# EAGLE design Qwiic_Spectral_Sensor-AS7265x (EAGLE 9.2.1)

## Sheet 1 of 2
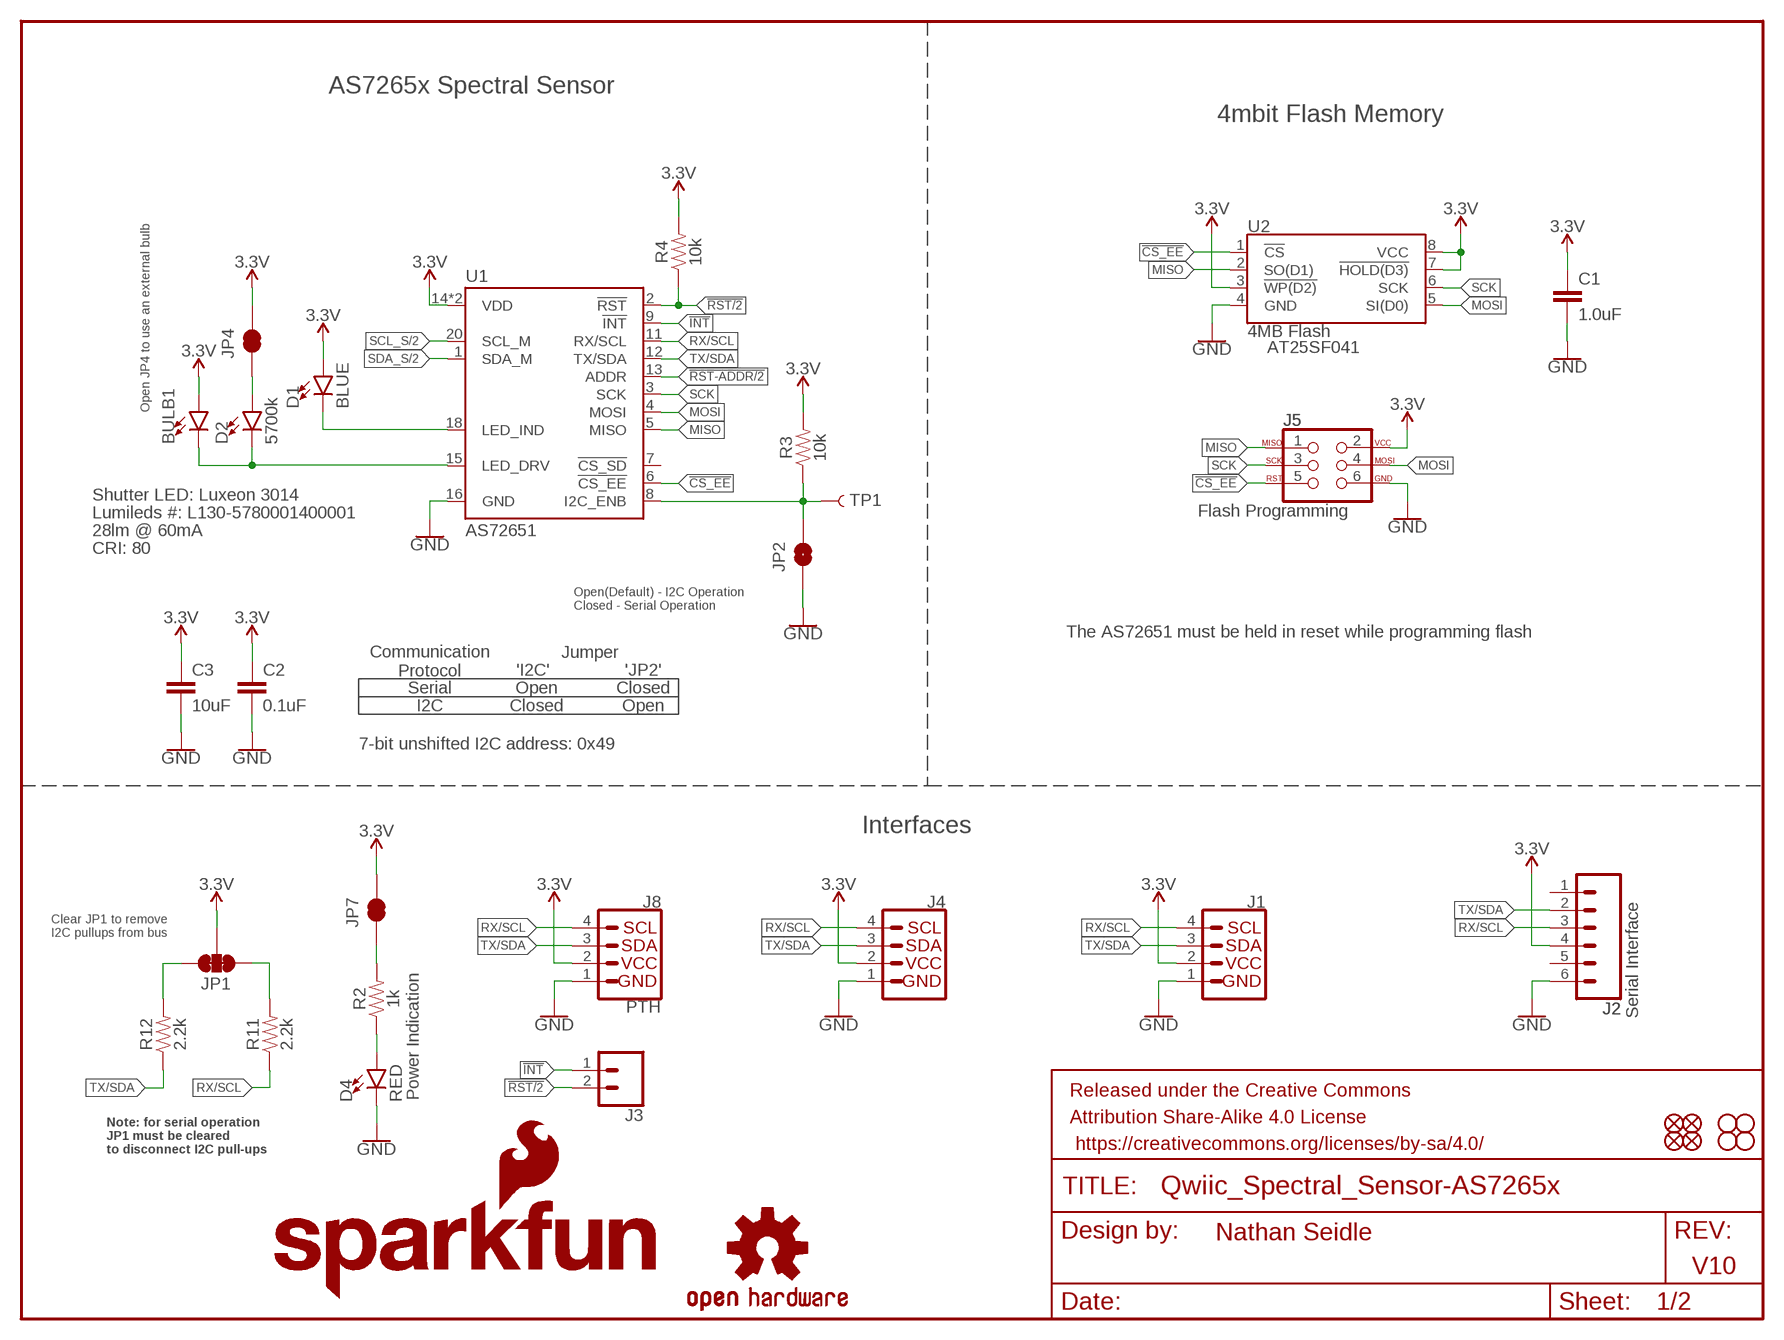
[diagram p0: schematic, sheet 1]

### Parts
BULB1  LEDNS  [LED_5MM_NOSILK]
C1  1.0uF  1.0UF-0603-16V-10%  [0603]
C2  0.1uF  0.1UF-0603-25V-(+80/-20%)  [0603]
C3  10uF  10UF-0603-6.3V-20%  [0603]
D1  BLUE  LED-BLUE0603  [LED-0603]
D2  5700k  LED-WHITE3014  [SUPER_BRIGHT_SMD_LED_3014]
D4  RED  LED-RED0603  [LED-0603]
FD1  FIDUCIAL1X2  [FIDUCIAL-1X2]
FD2  FIDUCIAL1X2  [FIDUCIAL-1X2]
FD3  FIDUCIAL1X2  [FIDUCIAL-1X2]
FD4  FIDUCIAL1X2  [FIDUCIAL-1X2]
FRAME1  FRAME-LETTER  [CREATIVE_COMMONS]
H1  STAND-OFF  [STAND-OFF]
H2  STAND-OFF  [STAND-OFF]
H3  STAND-OFF  [STAND-OFF]
H4  STAND-OFF  [STAND-OFF]
J1  QWIIC_CONNECTORJS-1MM  [1X04_1MM_RA]
J2  Serial Interface  CONN_06NO_SILK_FEMALE_PTH  [1X06_NO_SILK]
J3  CONN_021X02_NO_SILK  [1X02_NO_SILK]
J4  QWIIC_CONNECTORJS-1MM  [1X04_1MM_RA]
J5  Flash Programming  AVR_SPI_PROG_3X2TESTPOINTS  [2X3_TEST_POINTS]
J8  PTH  I2C_STANDARD_NO_SILK  [1X04_NO_SILK]
JP1  JUMPER-SMT_3_2-NC_TRACE_SILK  [SMT-JUMPER_3_2-NC_TRACE_SILK]
JP2  JUMPER-SMT_2_NO_SILK  [SMT-JUMPER_2_NO_SILK]
JP4  JUMPER-SMT_2_NC_TRACE_NO-SILK  [SMT-JUMPER_2_NC_TRACE_NO-SILK]
JP7  JUMPER-SMT_2_NC_TRACE_NO-SILK  [SMT-JUMPER_2_NC_TRACE_NO-SILK]
LOGO1  SFE_LOGO_NAME_FLAME.1_INCH  [SFE_LOGO_NAME_FLAME_.1]
LOGO4  OSHW-LOGOS  [OSHW-LOGO-S]
R2  1k  1KOHM-0603-1/10W-1%  [0603]
R3  10k  10KOHM-0603-1/10W-1%  [0603]
R4  10k  10KOHM-0603-1/10W-1%  [0603]
R11  2.2k  2.2KOHM-0603-1/10W-1%  [0603]
R12  2.2k  2.2KOHM-0603-1/10W-1%  [0603]
TP1  TEST-POINT3  [PAD.03X.03]
U1  AS72651  [LGA20]
U2  4MB Flash  AT25SF041  [SO08]

### Nets
3.3V [Power]: BULB1.A C1.1 C2.1 C3.1 D1.A J1.2 J2.4 J4.2 J5.2 J8.2 JP1.2 JP4.2 JP7.2 R3.2 R4.2 U1.14(VDD) U1.17(VDD) U2.3(!WP(D2)) U2.7(!HOLD(D3)) U2.8(VCC) ; also sheet 2
!CS_EE: J5.5 U1.6(!CS_EE) U2.1(!CS)
!INT: J3.1 U1.9(!INT)
!RST: J3.2 R4.1 U1.2(!RST) ; also sheet 2
!RST-ADDR: U1.13(ADDR) ; also sheet 2
GND: C1.2 C2.2 C3.2 D4.C J1.1 J2.6 J4.1 J5.6 J8.1 JP2.1 U1.16(GND) U2.4(GND) ; also sheet 2
I2C_ENB: JP2.2 R3.1 TP1.P$1 U1.8(I2C_ENB)
LED_DRV: BULB1.K(C) D2.C U1.15(LED_DRV)
MISO: J5.1 U1.5(MISO) U2.2(SO(D1))
MOSI: J5.4 U1.4(MOSI) U2.5(SI(D0))
N$1: JP7.1 R2.2
N$2: D1.C U1.18(LED_IND)
N$4: JP1.3 R12.2
N$5: JP1.1 R11.2
N$6: D2.A JP4.1
N$7: D4.A R2.1
RX/SCL: J1.4 J2.3 J4.4 J8.4 R11.1 U1.11(RX/SCL)
SCK: J5.3 U1.3(SCK) U2.6(SCK)
SCL_S: U1.20(SCL_M) ; also sheet 2
SDA_S: U1.1(SDA_M) ; also sheet 2
TX/SDA: J1.3 J2.2 J4.3 J8.3 R12.1 U1.12(TX/SDA)
Unconnected: J2.1 J2.5 U1.7(!CS_SD)

### Notes on the sheet
- AS7265x Spectral Sensor
- 4mbit Flash Memory
- AT25SF041
- Open JP4 to use an external bulb
- Shutter LED: Luxeon 3014
- Lumileds #: L130-5780001400001
- 28lm @ 60mA
- CRI: 80
- Open(Default) - I2C Operation
  Closed - Serial Operation
- The AS72651 must be held in reset while programming flash
- Jumper
- Communication
  Protocol
- 'I2C' | 'JP2'
- Serial | Open | Closed
- I2C | Closed | Open
- 7-bit unshifted I2C address: 0x49
- Interfaces
- Clear JP1 to remove
  I2C pullups from bus
- Power Indication
- Note: for serial operation
  JP1 must be cleared
  to disconnect I2C pull-ups
- Nathan Seidle
- V10

## Sheet 2 of 2
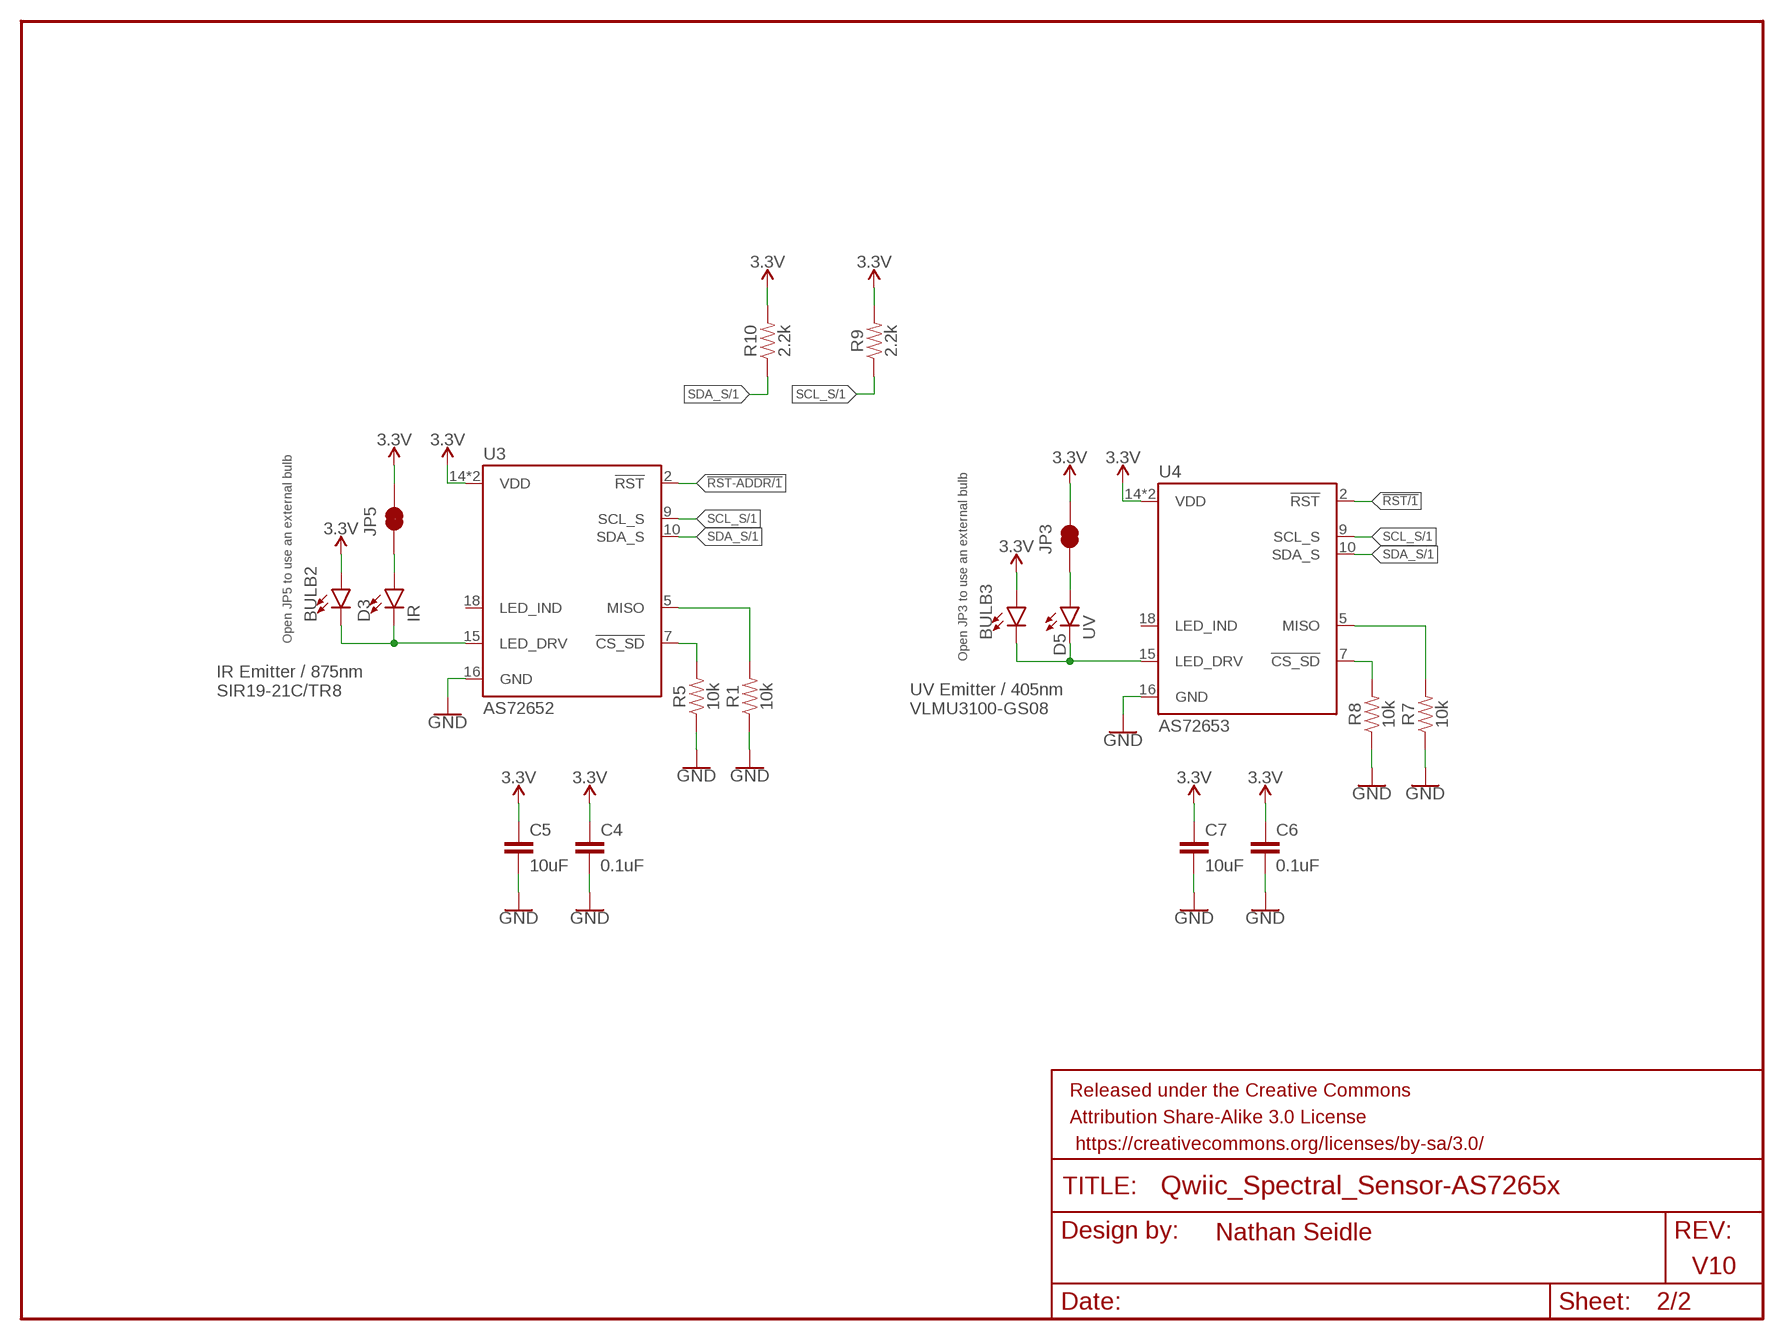
[diagram p1: schematic, sheet 2]

### Parts
BULB2  LEDNS  [LED_5MM_NOSILK]
BULB3  LEDNS  [LED_5MM_NOSILK]
C4  0.1uF  0.1UF-0603-25V-(+80/-20%)  [0603]
C5  10uF  10UF-0603-6.3V-20%  [0603]
C6  0.1uF  0.1UF-0603-25V-(+80/-20%)  [0603]
C7  10uF  10UF-0603-6.3V-20%  [0603]
D3  IR  LED-IR0603  [LED-0603]
D5  UV  LED-UVPLCC  [PLCC-2]
FRAME3  FRAME-LETTER  [CREATIVE_COMMONS]
JP3  JUMPER-SMT_2_NC_TRACE_NO-SILK  [SMT-JUMPER_2_NC_TRACE_NO-SILK]
JP5  JUMPER-SMT_2_NC_TRACE_NO-SILK  [SMT-JUMPER_2_NC_TRACE_NO-SILK]
R1  10k  10KOHM-0603-1/10W-1%  [0603]
R5  10k  10KOHM-0603-1/10W-1%  [0603]
R7  10k  10KOHM-0603-1/10W-1%  [0603]
R8  10k  10KOHM-0603-1/10W-1%  [0603]
R9  2.2k  2.2KOHM-0603-1/10W-1%  [0603]
R10  2.2k  2.2KOHM-0603-1/10W-1%  [0603]
U3  AS72652  [LGA20]
U4  AS72653  [LGA20]

### Nets
3.3V [Power]: BULB2.A BULB3.A C4.1 C5.1 C6.1 C7.1 JP3.2 JP5.2 R9.2 R10.2 U3.14(VDD) U3.17(VDD) U4.14(VDD) U4.17(VDD) ; also sheet 1
!RST: U4.2(!RST) ; also sheet 1
!RST-ADDR: U3.2(!RST) ; also sheet 1
GND: C4.2 C5.2 C6.2 C7.2 R1.1 R5.1 R7.1 R8.1 U3.16(GND) U4.16(GND) ; also sheet 1
LED_DRV1: BULB2.K(C) D3.C U3.15(LED_DRV)
LED_DRV2: BULB3.K(C) D5.C U4.15(LED_DRV)
N$3: R5.2 U3.7(!CS_SD)
N$8: D3.A JP5.1
N$9: R1.2 U3.5(MISO)
N$11: D5.A JP3.1
N$12: R8.2 U4.7(!CS_SD)
N$13: R7.2 U4.5(MISO)
SCL_S: R9.1 U3.9(SCL_S) U4.9(SCL_S) ; also sheet 1
SDA_S: R10.1 U3.10(SDA_S) U4.10(SDA_S) ; also sheet 1
Unconnected: U3.18(LED_IND) U4.18(LED_IND)

### Notes on the sheet
- Open JP5 to use an external bulb
- Open JP3 to use an external bulb
- IR Emitter / 875nm
  SIR19-21C/TR8
- UV Emitter / 405nm
  VLMU3100-GS08
- Nathan Seidle
- V10

## Library data of the parts
BULB1-BULB3 = SparkX:LED
C1 = SparkFun-Capacitors:1.0UF: 1µF ceramic capacitors A capacitor is a passive two-terminal electrical component used to store electrical energy temporarily in an electric field.; PROD_ID: CAP-00868
C2 C4 C6 = SparkFun-Capacitors:0.1UF: 0.1µF ceramic capacitors A capacitor is a passive two-terminal electrical component used to store electrical energy temporarily in an electric field.; PROD_ID: CAP-00810
C3 C5 C7 = SparkFun-Capacitors:10UF: 10.0µF ceramic capacitors A capacitor is a passive two-terminal electrical component used to store electrical energy temporarily in an electric field.; PROD_ID: CAP-11015
D1 = SparkFun-LED:LED-BLUE: Blue SMD LED Used in manufacturing of various products at SparkFun Packages: 0603 - SMD 0603 package [Product Link] <http://www.digikey.com/product-detail/en/SMLE12BC7TT86/511-1589-2-ND/1641808> 1206 - SMD1206 package [Product Link] <http://www.digikey.com/product-detail/en/lite-on-inc/LTST-C150TBKT/160-1643-1-ND/573584> SparkFun Products: ESP8266 Thing-Dev Board <https://www.sparkfun.com/products/13711> RedBoard <https://www.sparkfun.com/products/12757>; PROD_ID: DIO-08575
D2 = SparkFun-LED:LED-WHITE: White SMD LED Used in manufacturing several products at SparkFun. Packages: 0603 - Bright White SMD 0603 package[Product Link] <http://www.kingbrightusa.com/product.asp?catalog_name=LED&product_id=APT1608QWF/D> 1206 - Bright White SMD1206 package [Product Link] <http://www.kingbrightusa.com/product.asp?catalog_name=LED&product_id=APT3216QWF/D> 3014 - Super Bright SMD 3014 package [Datasheet] <http://www.lumileds.com/uploads/459/DS208-pdf> SparkFun Products: Blackberry Trackballer Breakout <https://www.sparkfun.com/products/13169> Digital SandBox <https://www.sparkfun.com/products/12651>; PROD_ID: DIO-13728; VALUE: White, 60mA
D3 = SparkFun-LED:LED-IR: Infrared LED (IR) Wavelength: 940nm Packages: TSAL6100 LTE302 - Side firing. Check SparkFun-Sensors.lbr for the receiver SparkFun Products: ZX Distance and Gesture Sensor <[https://www.sparkfun.com/products/12780]> Infrared Emitters and Detectors <https://www.sparkfun.com/products/241>; PROD_ID: DIO-14125
D4 = SparkFun-LED:LED-RED: Red SMD LED Used in manufacturing of most products at SparkFun Packages: 0603 - SMD 0603 package [Product Link] <http://docs.avagotech.com/docs/AV02-0551EN> 0603 SMART - SMD 0603 SMART package ( more efficient and expensive)[Product Link] <http://www.osram-os.com/Graphics/XPic2/00077099_0.pdf> 1206 - SMD1206 package [Product Link] <https://www.sparkfun.com/datasheets/DevTools/LilyPad/Q150OVS4.pdff> SparkFun Products: Pro Mini 328 -5V <https://www.sparkfun.com/products/821> RedBoard <https://www.sparkfun.com/products/12757> IOIO-OTG <https://www.sparkfun.com/products/13613>; PROD_ID: DIO-00819
D5 = SparkFun-LED:LED-UV; PROD_ID: DIO-14126
FD1-FD4 = SparkFun-Aesthetics:FIDUCIAL: Fiducial Alignment Points Point-of-reference for pick-and-place machines and other optical instruments.
FRAME1 = SparkFun-Aesthetics:FRAME-LETTER: Schematic Frame - Letter Standard 8.5x11 US Letter frame
FRAME3 = SparkFun-Retired:FRAME-LETTER: Schematic Frame Standard 8.5x11 US Letter frame
H1-H4 = SparkFun-Hardware:STAND-OFF: Stand Off Drill holes for mechanically mounting via screws, standoffs, etc. Note: Use the keepout ring to avoid running the screw head into surrounding components. Variant Overviews STAND-OFF - Mechanical footprint for a #4 phillips button head screw. STAND-OFF-TIGHT - Mechanical footprint for a #4 phillips button head screw, Example SparkFun Products Screw - Phillips Head (1/4", 4-40, 10 pack) <https://www.sparkfun.com/products/10453> (PRT-10453) Screw - Phillips Head (1/2", 4-40, 10 pack) <https://www.sparkfun.com/products/10452> (PRT-10452) Screw - Phillips Head (3/4", 4-40, 10 pack) <https://www.sparkfun.com/products/10451> (PRT-10451) Screw - Phillips Head (1", 4-40, 10 pack) <https://www.sparkfun.com/products/10450> (PRT-10450)
J1 J4 = SparkFun-Connectors:QWIIC_CONNECTOR: SparkFun I2C Standard Qwiic Connector An SMD 1mm pitch JST connector makes it easy and quick (get it? Qwiic?) to connect I2C devices to each other. The Qwiic system <http://www.sparkfun.com/qwiic> enables fast and solderless connection between popular platforms and various sensors and actuators. We carry 200mm <https://www.sparkfun.com/products/14204>, 100mm <https://www.sparkfun.com/products/14205>, 50mm <https://www.sparkfun.com/products/14206>, and breadboard friendly <https://www.sparkfun.com/products/14207> Qwiic cables. We also offer 10 pcs strips <https://www.sparkfun.com/products/14323> the SMD connectors.; PROD_ID: CONN-13694
J2 = SparkFun-Connectors:CONN_06: Multi connection point. Often used as Generic Header-pin footprint for 0.1 inch spaced/style header connections On any of the 0.1 inch spaced packages, you can populate with these: Break Away Headers - Straight <https://www.sparkfun.com/products/116> (PRT-00116) Break Away Male Headers - Right Angle <https://www.sparkfun.com/products/553> (PRT-00553) Female Headers <https://www.sparkfun.com/products/115> (PRT-00115) Break Away Headers - Machine Pin <https://www.sparkfun.com/products/117> (PRT-00117) Break Away Female Headers - Swiss Machine Pin <https://www.sparkfun.com/products/743> (PRT-00743) Arduino Stackable Header - 6 Pin <https://www.sparkfun.com/products/9280> (PRT-09280) For SCREWTERMINALS and SPRING TERMINALS visit here: Screw Terimnals on SparkFun.com <https://www.sparkfun.com/search/results?term=Screw+Terminals> (5mm/3.5mm/2.54mm spacing) This device is also useful as a general connection point to wire up your design to another part of your project. Our various solder wires solder well into these plated through hole pads. Hook-Up Wire - Assortment (Stranded, 22 AWG) <https://www.sparkfun.com/products/11375> (PRT-11375) Hook-Up Wire - Assortment (Solid Core, 22 AWG) <https://www.sparkfun.com/products/11367> (PRT-11367) View the entire wire category on our website here <https://www.sparkfun.com/categories/141>; PROD_ID: CONN-08437
J3 = SparkFun-Connectors:CONN_02: Multi connection point. Often used as Generic Header-pin footprint for 0.1 inch spaced/style header connections On any of the 0.1 inch spaced packages, you can populate with these: Break Away Headers - Straight <https://www.sparkfun.com/products/116> (PRT-00116) Break Away Male Headers - Right Angle <https://www.sparkfun.com/products/553> (PRT-00553) Female Headers <https://www.sparkfun.com/products/115> (PRT-00115) Break Away Headers - Machine Pin <https://www.sparkfun.com/products/117> (PRT-00117) Break Away Female Headers - Swiss Machine Pin <https://www.sparkfun.com/products/743> (PRT-00743) For SCREWTERMINALS and SPRING TERMINALS visit here: Screw Terimnals on SparkFun.com <https://www.sparkfun.com/search/results?term=Screw+Terminals> (5mm/3.5mm/2.54mm spacing) This device is also useful as a general connection point to wire up your design to another part of your project. Our various solder wires solder well into these plated through hole pads. Hook-Up Wire - Assortment (Stranded, 22 AWG) <https://www.sparkfun.com/products/11375> (PRT-11375) Hook-Up Wire - Assortment (Solid Core, 22 AWG) <https://www.sparkfun.com/products/11367> (PRT-11367) View the entire wire category on our website here <https://www.sparkfun.com/categories/141> Special notes: Molex polarized connector foot print use with: PRT-08233 with associated crimp pins and housings. 2.54_SCREWTERM for use with PRT-10571. 3.5mm Screw Terminal footprints for PRT-08084 5mm Screw Terminal footprints for use with PRT-08432
J5 = SparkFun-Connectors:AVR_SPI_PROG_3X2: AVR ISP 6 Pin This is the reduced ISP connector for AVR programming. Common on Arduino. This footprint will take up less PCB space and can be used with a 10-pin to 6-pin adapter such as SKU: BOB-08508 **Special note about "TEST_POINT" package. The stop mask is on the top side, so if you want your programming test points to be on the bottom of your board, make sure to place this package on the bottom side of the board. This also ensure that the orientation to program from the bottom side will be correct. SparkFun Products: SparkFun ISP Pogo Adapter <https://www.sparkfun.com/products/11591> - NS Tiny AVR Programmer <https://www.sparkfun.com/products/11801> -PTH
J8 = SparkFun-Connectors:I2C_STANDARD: SparkFun I2C Standard Pinout Header SparkFun has standardized on a pinout for all I2C based sensor breakouts. This pinout allows I2C boards to be plugged directly into the headers on Arduino Uno compatible boards, and to be daisy chained easily. Example SparkFun Products: SparkFun Atmospheric Sensor Breakout - BME280 <https://www.sparkfun.com/products/13676> SparkFun Altitude/Pressure Sensor Breakout - MPL3115A2 <https://www.sparkfun.com/products/11084> SparkFun TOF Range Finder Sensor - VL6180 <https://www.sparkfun.com/products/12785>
JP1 = SparkFun-Jumpers:JUMPER-SMT_3_2-NC_TRACE: Normally closed trace jumper (2 of 2 connections) This jumper has a trace between all three pads so they are normally closed (NC). Use a razor knife to open the connection(s). For best results follow the IPC guidelines for cutting traces: Cutout at least 0.063 mm (0.005 in). Remove all loose material to clean up the cut area. Seal the cut with an approved epoxy. Reapply solder to reclose the connection(s).
JP2 = SparkFun-Jumpers:JUMPER-SMT_2_NO: Normally open jumper This jumper has two pads in close proximity to each other. Apply solder to close the connection. Round pads are easier to solder for beginners, but are a lot larger. SparkFun Product that uses the round pads: SparkFun EL Sequencer <https://www.sparkfun.com/products/12781>
JP3-JP5 JP7 = SparkFun-Jumpers:JUMPER-SMT_2_NC_TRACE: Normally closed trace jumper This jumper has a trace between two pads so it's normally closed (NC). Use a razor knife to open the connection. For best results follow the IPC guidelines for cutting traces: Cutout at least 0.063 mm (0.005 in). Remove all loose material to clean up the cut area. Seal the cut with an approved epoxy. Reapply solder to reclose the connection.
LOGO1 = SparkFun-Aesthetics:SFE_LOGO_NAME_FLAME: SparkFun Font Logo w/ Flame This is the SparkFun full logo. The logo on the schematic will always be the same size; the package variant is the height of the flame part of the logo. Default layer for the logo on the board is tSilk.
LOGO4 = SparkFun-Aesthetics:OSHW-LOGO: Open-Source Hardware (OSHW) Logo This logo indicates the piece of hardware it is found on incorporates a OSHW license and/or adheres to the definition of open source hardware found here: http://freedomdefined.org/OSHW
R1 R3-R5 R7 R8 = SparkFun-Resistors:10KOHM: 10kΩ resistor A resistor is a passive two-terminal electrical component that implements electrical resistance as a circuit element. Resistors act to reduce current flow, and, at the same time, act to lower voltage levels within circuits. - Wikipedia; PROD_ID: RES-00824
R2 = SparkFun-Resistors:1KOHM: 1kΩ resistor A resistor is a passive two-terminal electrical component that implements electrical resistance as a circuit element. Resistors act to reduce current flow, and, at the same time, act to lower voltage levels within circuits. - Wikipedia; PROD_ID: RES-07856
R9-R12 = SparkFun-Resistors:2.2KOHM: 2.2kΩ resistor A resistor is a passive two-terminal electrical component that implements electrical resistance as a circuit element. Resistors act to reduce current flow, and, at the same time, act to lower voltage levels within circuits. - Wikipedia; PROD_ID: RES-08272
TP1 = SparkFun-Connectors:TEST-POINT: SparkFun Test Points Bare copper test points for troubleshooting or In-Circuit-Testing. These are used by our Production team for verifying production board runs using pogo-pins on test beds. SparkFun Products: SparkFun LSM9DS1 Breakout <https://www.sparkfun.com/products/13284> SparkFun PSOC <https://www.sparkfun.com/products/13714> SparkFun Load Cell Amplifier <https://www.sparkfun.com/products/13879>
U1 = Qwiic_Spectral_Sensor-AS7265x:AS72651; PROD_ID: IC-14127
U2 = SparkFun-IC-Memory:AT25SF041: AT25SF041 4Mb Serial Flash Memory 104MHz, SPI, 8-SOIC Datasheet <http://www.adestotech.com/wp-content/uploads/DS-AT25SF041_044.pdf> SparkFun Products: SparkFun ESP8266 Thing <https://www.sparkfun.com/products/13231> SparkFun ESP8266 Thing - Dev Board <https://www.sparkfun.com/products/13711>; PROD_ID: IC-12455
U3 = Qwiic_Spectral_Sensor-AS7265x:AS72652; PROD_ID: IC-14128
U4 = Qwiic_Spectral_Sensor-AS7265x:AS72653; PROD_ID: IC-14129

## Net classes
1 Power: width 0.305 mm

## Board
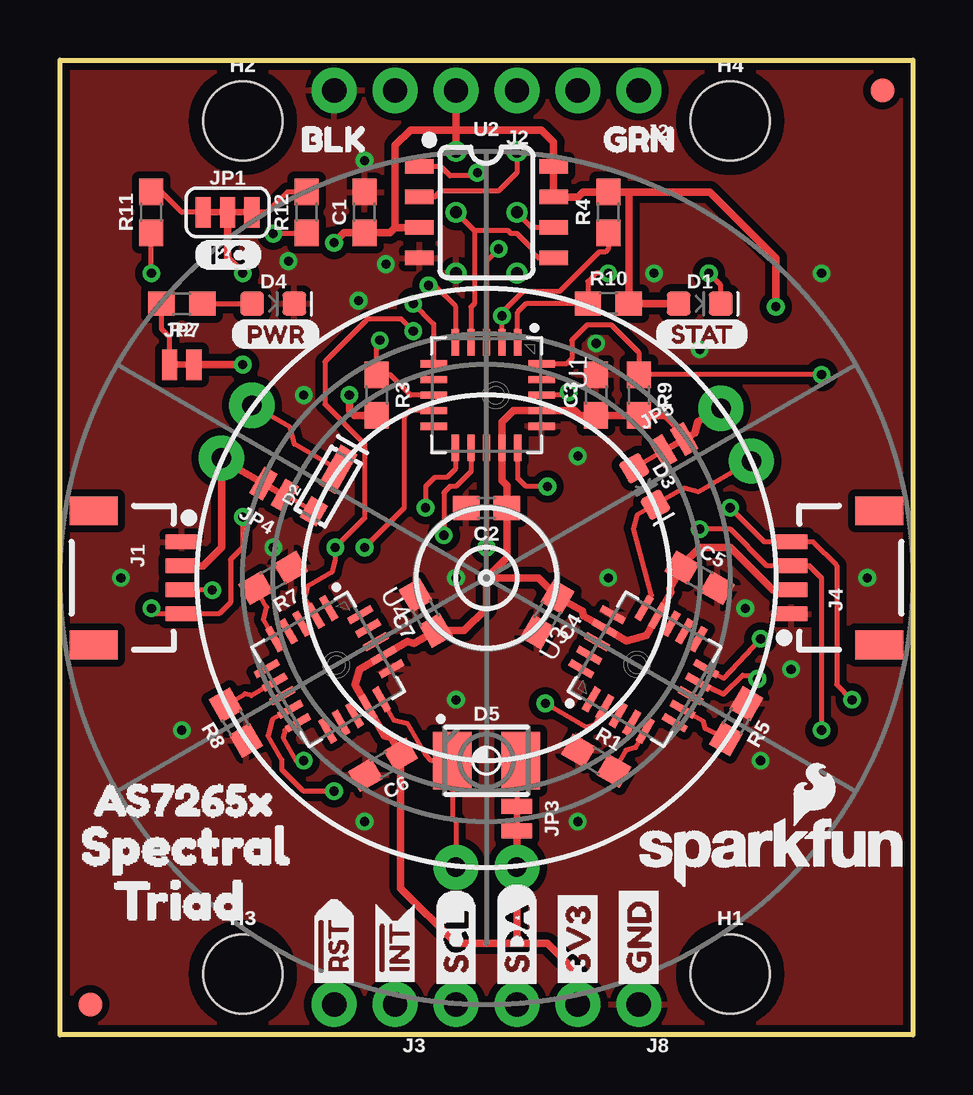
[diagram p2: board, top side]
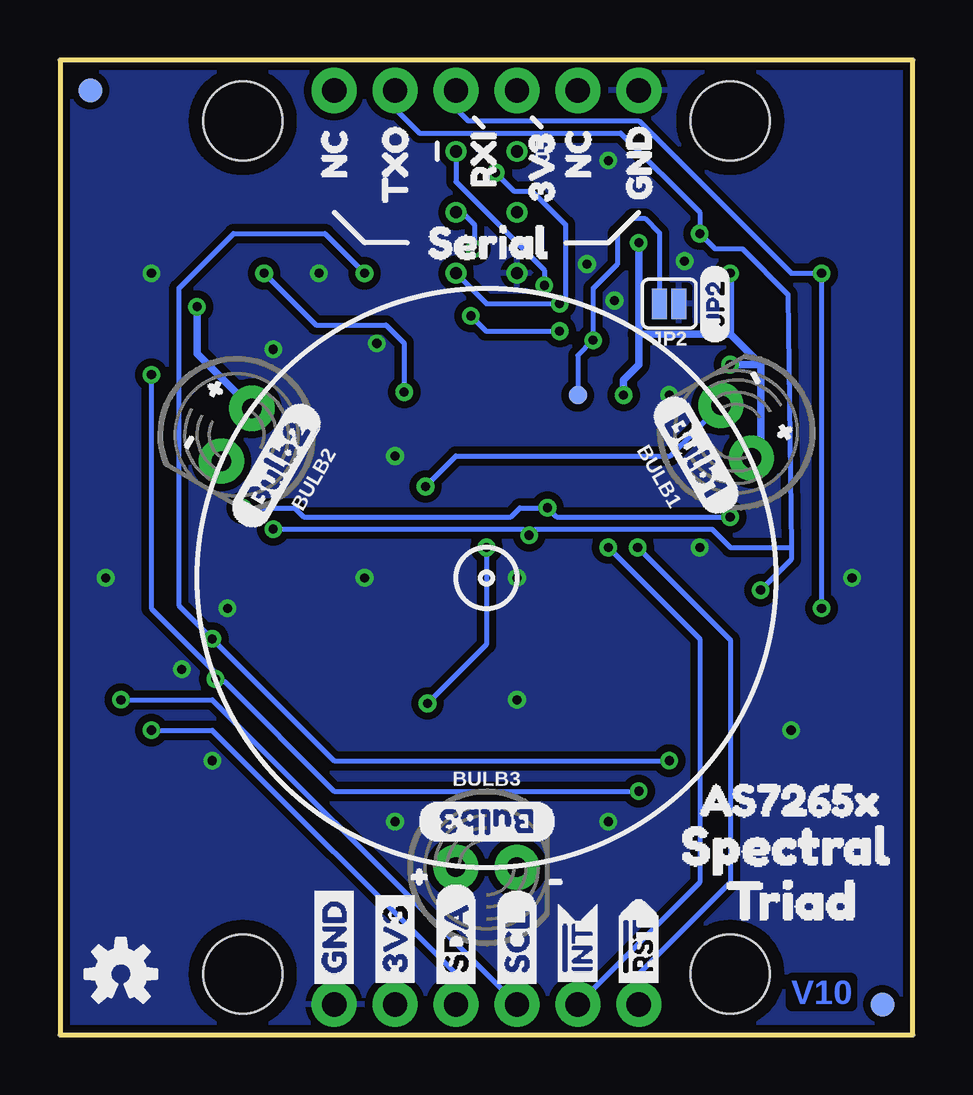
[diagram p3: board, bottom side, seen from below]

Size 35.56 x 40.64 mm. Coordinates in mm from the lower left corner, seen from the top.
Outline: 0,0 0,40.64 35.56,40.64 35.56,0 0,0
Copper layers (1*16): Top 0.035mm / dielectric 1.5mm / Bottom 0.035mm
Design rules "SparkFun-2-layer-TIGHT *": minimum track width 7mil, minimum drill 15mil, track to track 7mil, track to pad 7mil, pad to pad 7mil, via to via 7mil, smd to smd 7mil, copper to edge 7mil, drill to drill 7mil, minimum pad ring 7mil, minimum via ring 7mil, stop-mask expansion 4mil, vias tented up to drill 25mil, thermal gap 10mil

### Footprints (pad centres in the part's own frame; a part is rotated, then mirrored left to right if it is on the bottom)
LED_5MM_NOSILK = drill 0.813 pad 1.88: A -1.27,0; K 1.27,0
0603 = smd 1.1 x 1: 1 -0.85,0; 2 0.85,0
LED-0603 = smd 1 x 1: A -0.877,0; C 0.877,0
SUPER_BRIGHT_SMD_LED_3014 = smd 1 x 0.8: A -1.2,0 | smd 1.9 x 0.8: C 0.827,0
PLCC-2 = smd 1.6 x 2.4: A 1.425,0; C -1.425,0
FIDUCIAL-1X2 = smd 1 x 1: 1 0,0
STAND-OFF = hole 3.302: 0,0
1X04_1MM_RA = smd 0.6 x 1.35: 1 -1.5,0; 2 -0.5,0; 3 0.5,0; 4 1.5,0 | smd 1.2 x 2: NC1 2.8,-3.675; NC2 -2.8,-3.675
1X06_NO_SILK = drill 1.016 pad 1.88: 1 0,0; 2 2.54,0; 3 5.08,0; 4 7.62,0; 5 10.16,0; 6 12.7,0
1X02_NO_SILK = drill 1.016 pad 1.88: 1 0,0; 2 2.54,0
2X3_TEST_POINTS = drill 0.508: 1 -2.54,-1.27; 2 -2.54,1.27; 3 0,-1.27; 4 0,1.27; 5 2.54,-1.27; 6 2.54,1.27
1X04_NO_SILK = drill 1.016 pad 1.88: 1 0,0; 2 2.54,0; 3 5.08,0; 4 7.62,0
SMT-JUMPER_3_2-NC_TRACE_SILK = smd 0.635 x 1.27: 1 -1.016,0; 2 0,0; 3 1.016,0
SMT-JUMPER_2_NO_SILK = smd 0.635 x 1.27: 1 -0.406,0; 2 0.406,0
SMT-JUMPER_2_NC_TRACE_NO-SILK = smd 0.635 x 1.27: 1 -0.508,0; 2 0.508,0
PAD.03X.03 = smd 0.762 x 0.762: P$1 0,0
LGA20 = smd 1.1 x 0.3: 1 -2.2,1.3; 2 -2.2,0.65; 3 -2.2,0; 4 -2.2,-0.65; 5 -2.2,-1.3; 11 2.2,-1.3; 12 2.2,-0.65; 13 2.2,0; 14 2.2,0.65; 15 2.2,1.3 | smd 0.3 x 1.1: 6 -1.3,-2.2; 7 -0.65,-2.2; 8 0,-2.2; 9 0.65,-2.2; 10 1.3,-2.2; 16 1.3,2.3; 17 0.65,2.3; 18 0,2.3; 19 -0.65,2.3; 20 -1.3,2.3
SO08 = smd 0.6 x 1.2: 1 -1.905,-2.8; 2 -0.635,-2.8; 3 0.635,-2.8; 4 1.905,-2.8; 5 1.905,2.8; 6 0.635,2.8; 7 -0.635,2.8; 8 -1.905,2.8

### Placement (x,y rotation side)
BULB1  7.37,25.15 120 bottom
BULB2  28.19,25.02 240 bottom
BULB3  17.78,6.99 0 bottom
C1  12.7,34.29 90 top
C2  17.78,21.97 180 top
C3  22.35,26.67 90 top
C4  20.32,17.53 240 top
C5  26.67,19.05 330 top
C6  13.47,11.26 210 top
C7  15.25,17.59 120 top
D1  26.67,30.48 0 top
D2  11.18,22.86 60 top
D3  24.38,22.86 300 top
D4  8.89,30.48 0 top
D5  17.78,11.43 0 top
FD1  1.27,1.27 0 top
FD2  34.29,39.37 0 top
FD3  34.29,39.37 0 bottom
FD4  1.27,1.27 0 bottom
FRAME1  -11.43,-30.48 0 top  (outside the outline)
FRAME3  -11.43,-40.64 0 top  (outside the outline)
H1  27.94,2.54 0 top
H2  7.62,38.1 0 top
H3  7.62,2.54 0 top
H4  27.94,38.1 0 top
J1  5.08,19.05 270 top
J2  24.13,39.37 180 top
J3  13.97,1.27 180 top
J4  30.48,19.05 90 top
J5  17.78,34.29 270 bottom
J8  24.13,1.27 180 top
JP1  6.98,34.29 0 top
JP2  10.16,30.48 180 bottom
JP3  19.05,9.02 270 top
JP4  8.93,22.73 150 top
JP5  25.58,24.58 30 top
JP7  5.08,27.94 0 top
LOGO1  29.72,7.62 0 top
LOGO4  33.02,2.54 0 bottom
R1  22.35,11.43 330 top
R2  5.08,30.48 180 top
R3  13.21,26.67 270 top
R4  22.86,34.29 90 top
R5  28.19,13.08 240 top
R7  8.89,19.05 210 top
R8  7.33,13.02 120 top
R9  24.13,26.67 270 top
R10  22.86,30.48 0 top
R11  3.81,34.29 90 top
R12  10.29,34.29 90 top
TP1  13.97,26.67 0 bottom
U1  17.78,26.67 270 top
U2  17.78,34.29 270 top
U3  24.38,15.24 60 top
U4  11.18,15.24 300 top
U$1  [#0]  29.84,25.91 60 bottom
U$2  [I_SUPER2_C-()-03]  5.59,32.51 0 top
U$3  [PWR-()-03]  7.11,29.21 0 top
U$4  [AS7265X0]  0.25,9.78 0 top
U$5  [BULB15]  10.41,26.54 300 bottom
U$6  [BULB26]  28.07,21.08 60 bottom
U$7  [BULB37]  14.86,8.89 180 bottom
U$8  [JP20]  8.25,28.83 90 bottom
U$9  [SPECTRAL1]  -0.51,7.87 0 top
U$10  [STAT4]  24.76,29.21 0 top
U$11  [TRIAD2]  0.89,5.59 0 top
U$12  [TRIAD2]  9.14,5.59 0 bottom
U$13  [SPECTRAL1]  11.05,7.87 0 bottom
U$14  [AS7265X0]  10.03,9.78 0 bottom
U$15  [3V33]  15.49,33.65 90 bottom
U$16  [BLK7]  9.14,37.34 0 top
U$17  [GND5]  11.43,33.91 90 bottom
U$18  [GRN6]  21.59,37.34 0 top
U$19  [NC4]  24.13,34.8 90 bottom
U$20  [NC4]  13.97,34.8 90 bottom
U$21  [RXI2]  17.91,34.42 90 bottom
U$22  [SERIAL0]  21.34,33.02 0 bottom
U$23  [TXO1]  21.59,33.78 90 bottom
U$24  [3V3-04]  21.59,1.65 90 bottom
U$25  [GND-04]  24.13,1.65 90 bottom
U$26  [SDA-[)]  19.05,1.65 90 bottom
U$27  [SCL-[)]  16.51,1.65 90 bottom
U$28  [INT#-[<-04]  13.97,1.52 90 bottom
U$29  [RST#-[>-04]  11.43,1.52 90 bottom
U$30  [GND-04]  24.13,1.65 90 top
U$31  [3V3-04]  21.59,1.65 90 top
U$32  [SDA-[)]  19.05,1.65 90 top
U$33  [SCL-[)]  16.51,1.65 90 top
U$34  [INT#-[<-04]  13.97,1.52 90 top
U$35  [RST#-[>-04]  11.43,1.52 90 top
U$36  [#0]  5.84,26.29 300 bottom
U$37  [#0]  21.84,6.73 0 bottom
U$38  [#1]  16.13,6.6 0 bottom
U$39  [#1]  6.98,28.57 300 bottom
U$40  [#1]  30.99,23.75 60 bottom

### Tracks (layer width: path | path; a pad name or v marks a point on that pad's centre or on a via)
3.3V  (via drill 0.38)
  Top 0.203: 25.78,30.49 D1.A
  Top 0.305: U2.3 13.97,33.65 | 20.32,37.46 20.58,37.2 U2.8 U2.7 21.59,34.92 21.8,35.14 R4.2 23.75,35.14 | BULB2.A 26.59,25.56 26.46,25.09 JP5.2 26.02,25.03 25.23,25.82 R9.2 C3.1 21.68,25.82 21.48,26.02 U1.17 18.91,26.02 18.43,25.54 U1.14 18.43,23.1 18.63,22.9 C2.1 18.63,19.9 17.78,19.05 | JP3.2 BULB3.A 19.05,3.81 | JP4.2 6.75,23.99 6.73,24 BULB1.A 6.73,20.32 5.96,19.55 J1.2 | J4.2 29.71,18.55 27.94,20.32 26.67,20.32 25.93,19.58 C5.1 25.43,18.6 25.47,18.44 U3.14 24.44,16.65 23.62,16.43 U3.17 21.83,17.46 21.78,17.67 C4.1 19.96,19.05 17.78,19.05 | 25.78,35.14 23.75,35.14 | 25.78,35.14 27.09,35.14 29.84,32.38 v29.84,30.35 | v11.43,33.02 11.85,33.44 C1.1 13.75,33.44 13.97,33.65 | R3.2 12.28,25.82 12.06,26.03 v12.06,26.67 | 17.78,19.05 17.78,17.78 16.85,16.85 C7.1 14.76,16.33 14.49,16.4 U4.17 12.48,15.24 12.31,14.59 U4.14 13.53,12.47 13.79,12.4 C6.1 14.21,6.11 16.51,3.81 19.05,3.81 | 20.32,37.46 20.07,37.72 | 16,37.72 14.6,37.72 13.97,37.08 13.97,33.65 | 19.05,3.81 20.32,3.81 21.59,2.54 J8.2 | v7.62,31.75 6.98,32.38 JP1.2 | 25.79,35.13 25.78,35.14 | 20.32,37.46 | 16,37.72 | 16.51,37.72 16,37.72 | 20.07,37.72 16.51,37.72 | 20.07,37.72 | J2.4 16.51,37.72 | 16.51,37.72 | 16.51,37.72 J5.2 | J8.2 | JP7.2 v7.62,27.94 | R10.2 23.71,35.1 23.75,35.14 | D1.A R10.2 | R10.2
  Bottom 0.305: v29.84,30.35 29.84,28.4 BULB2.A | 11.43,29.21 7.62,29.21 | 7.62,29.21 6.35,27.94 | 6.35,27.94 6.35,24.43 BULB1.A | v11.43,33.02 11.43,29.21 | 11.43,29.21 11.43,27.94 12.06,27.3 v12.06,26.67 | v7.62,31.75 7.62,29.21 | v7.62,27.94 6.35,27.94
!CS_EE  (via drill 0.38)
  Top 0.203: U1.6 15.58,29.63 v14.73,30.48 | U2.1 15.87,36.19 16.26,35.81 17.27,35.81 v17.4,35.94
  Bottom 0.203: J5.5 17.78,30.48 v14.73,30.48 14.48,30.73 14.48,33.78 15.87,35.18 16.64,35.18 v17.4,35.94
!INT  (via drill 0.38)
  Top 0.203: U1.9 14.59,26.02 14.35,25.78 14.35,21.97 v12.7,20.32
  Bottom 0.203: J3.1 | J3.1 8.89,6.35 8.89,16.51 v12.7,20.32
!RST  (via drill 0.38)
  Top 0.203: U1.2 v18.43,29.97 18.43,30.11 19.3,30.99 20.83,30.99 22.48,32.64 22.73,32.64 22.86,32.77 R4.1 | v14.73,29.34 14.22,29.84 12.83,29.84 11.05,28.07 11.05,26.29 12.7,24.64 12.7,21.54 v11.48,20.32 11.48,19.81 11.34,19.29 10.35,18.72 10.21,18.22 U4.2
  Bottom 0.203: v18.43,29.97 17.79,29.34 v14.73,29.34 | v11.48,20.32 7.62,16.46 7.62,6.35 11.43,2.54 J3.2
!RST-ADDR  (via drill 0.38)
  Top 0.203: v20.23,13.82 21.96,12.82 22.28,12.91 U3.2 | U1.13 v17.78,20.32
  Bottom 0.203: v17.78,20.32 17.78,16.27 v20.23,13.82
GND  (via drill 0.38)
  other vias: 2.54,19.05 8.89,20.32 16.51,19.05 16.51,13.97 22.86,19.05 21.59,24.13 22.35,28.83 12.7,36.45 13.59,32.13 31.75,31.75 30.48,15.24 9.52,32.26 12.7,8.89 5.08,12.7 10.16,26.67 26.67,28.57 28.57,17.78 33.65,19.05 24.76,31.75 12.45,30.61 21.59,8.89 29.21,11.43
  pour Top (isolate 0.305): 0,0 35.56,0 35.56,40.64 0,40.64
  pour Bottom (isolate 0.305): 35.56,40.64 0,40.64 0,0 35.56,0
I2C_ENB  (via drill 0.38)
  Top 0.203: U1.8 14.6,26.67 13.75,27.52 R3.1 13.21,28.83 v13.33,28.96
  Bottom 0.203: JP2.2 10.57,33.43 11.18,34.04 11.68,34.04 12.32,33.4 12.32,32.13 13.33,31.11 v13.33,28.96 13.97,28.32 TP1.P$1
LED_DRV  (via drill 0.38)
  Top 0.203: BULB1.K 9.59,25.33 9.78,24.62 D2.C | U1.15 19.08,23.21 19.43,22.86 v20.32,22.86
  Bottom 0.203: v20.32,22.86 19.05,24.13 10.12,24.13 BULB1.K
LED_DRV1
  Top 0.203: BULB2.K 26.6,22.63 26.02,22.79 D3.C 24.06,21.66 23.91,21.12 24.66,18.33 U3.15
LED_DRV2
  Top 0.203: BULB3.K 16.51,8.89 16.35,9.04 D5.C | U4.15 13.91,13.11 14.51,12.95 15.24,11.68 15.49,11.43 D5.C | D5.C
MISO  (via drill 0.38)
  Top 0.203: U1.5 16.48,29.11 16.48,30.38 15.62,31.24 v15.37,31.24 | J5.1 19.05,35.94 18.54,35.43 18.29,35.18 15.87,35.18 15.62,34.92 U2.2 | J5.1
  Bottom 0.203: v15.37,31.24 15.37,31.88 19.05,35.56 J5.1
MOSI
  Top 0.203: J5.4 17.13,33.67 17.27,33.53 | U1.4 17.13,30.34 17.27,30.48 17.27,33.53 | U2.5 19.94,32.38 19.68,32.64 19.68,32.77 19.05,33.4 18.8,33.4 18.67,33.53 17.27,33.53 | 17.27,33.53
N$1
  Top 0.203: JP7.1 4.57,29.08 4.23,29.42 R2.2
N$2  (via drill 0.38)
  Top 0.203: D1.C 27.55,31.25 v27.05,31.75 | U1.18 21.21,26.67 v21.21,26.8
  Bottom 0.203: v21.21,26.8 21.21,28.83 21.97,29.59 24.89,29.59 v27.05,31.75
N$3
  Top 0.203: U3.7 26.82,13.08 26.9,12.77 R5.2
N$4
  Top 0.203: JP1.3 8.64,34.29 9.49,35.14 R12.2
N$5
  Top 0.203: R11.2 4.23,35.14 5.08,34.29 JP1.1
N$6
  Top 0.203: JP4.1 9.42,22.49 D2.A
N$7
  Top 0.203: R2.1 D4.A
N$8
  Top 0.203: JP5.1 D3.A
N$9
  Top 0.203: R1.2 23.58,11.87 24,11.98 U3.5
N$11
  Top 0.203: 19.05,11.43 JP3.1 | 19.05,11.43 | D5.A 19.05,11.43
N$12
  Top 0.203: U4.7 7.98,14.14 7.71,14.22 R8.2
N$13
  Top 0.203: R7.2 8.62,17.82 8.48,17.31 U4.5
RX/SCL  (via drill 0.38)
  Top 0.203: v3.81,31.75 R11.1 | U1.11 16.48,23.59 16.13,23.24 15.62,23.24 15.24,22.86 v15.24,21.97 | v27.94,21.97 29.36,20.55 J4.4 31.39,20.55 32.38,19.56 32.38,14.6 v33.02,13.97 | v7.62,21.59 7.62,20.32 7.11,19.81 7.11,18.03 6.63,17.55 J1.4 4.04,17.55 v3.81,17.78
  Bottom 0.203: J2.3 19.05,38.61 18.54,38.1 11.43,38.1 5.08,31.75 v3.81,31.75 | v3.81,31.75 v3.81,17.78 | v3.81,17.78 | v27.94,21.97 25.78,21.97 25.4,21.59 16.76,21.59 16.38,21.97 v15.24,21.97 14.86,21.59 v7.62,21.59 | v3.81,31.75 | v33.02,13.97 29.21,13.97 19.05,3.81 | 19.05,3.81 | 19.05,3.81 J8.4
SCK  (via drill 0.38)
  Top 0.203: U2.6 19.68,33.65 J5.3 | U1.3 17.78,32.26 v18.29,32.77
  Bottom 0.203: J5.3 18.8,34.29 18.29,33.78 v18.29,32.77
SCL_S  (via drill 0.38)
  Top 0.203: 23.37,29.21 24.13,28.45 R9.1 | U1.20 21.11,27.97 21.34,28.19 21.34,28.96 21.59,29.21 21.97,29.59 22.99,29.59 23.37,29.21 | v31.75,27.52 R9.1 | R9.1 | v11.43,10.16 10.16,10.16 9.24,11.08 9.24,11.48 8.67,12.47 8.85,13.14 U4.9 | v29.08,14.84 28.93,14.99 28.45,14.99 27.67,14.2 U3.9 | 23.37,29.21
  Bottom 0.203: v11.43,10.16 24.13,10.16 28.69,14.72 28.96,14.72 v29.08,14.84 29.06,14.85 29.06,15.09 31.75,17.78 v31.75,27.52
SDA_S  (via drill 0.38)
  Top 0.203: U1.1 19.08,30.13 19.43,30.48 R10.1 22.01,31.41 22.35,31.75 v22.86,31.75 | v10.16,11.43 10.14,11.41 9.87,11.41 9.3,12.4 9.38,12.7 U4.10 | v29.21,16.51 27.69,14.86 U3.10
  Bottom 0.203: v22.86,31.75 24.51,33.4 28.32,33.4 30.61,31.11 30.61,17.91 v29.21,16.51 24.13,11.43 v10.16,11.43
TX/SDA  (via drill 0.38)
  Top 0.203: U1.12 17.13,23.48 16.51,22.86 16.26,22.86 16,22.61 v16,20.83 | v26.67,21.08 27.94,21.08 29.47,19.55 J4.3 31.25,19.55 31.75,19.05 v31.75,12.7 | J1.3 5.85,18.55 v6.35,18.54 | R12.1 10.25,33.4 v8.89,33.4
  Bottom 0.203: J2.2 21.59,38.61 20.57,37.59 12.19,37.59 8.89,34.29 v8.89,33.4 8.25,32.77 7.11,32.77 5.21,30.86 5.08,20.32 | 5.08,20.32 5.08,19.81 v6.35,18.54 | J8.3 19.05,2.54 29.21,12.7 v31.75,12.7 | 5.08,20.32 7.62,20.32 8.38,21.08 15.75,21.08 v16,20.83 16.26,21.08 v26.67,21.08

### Text on the board
Bottom: V10
tDocu: Nathan Seidle